# Altium project ControlUnit.PrjPCB
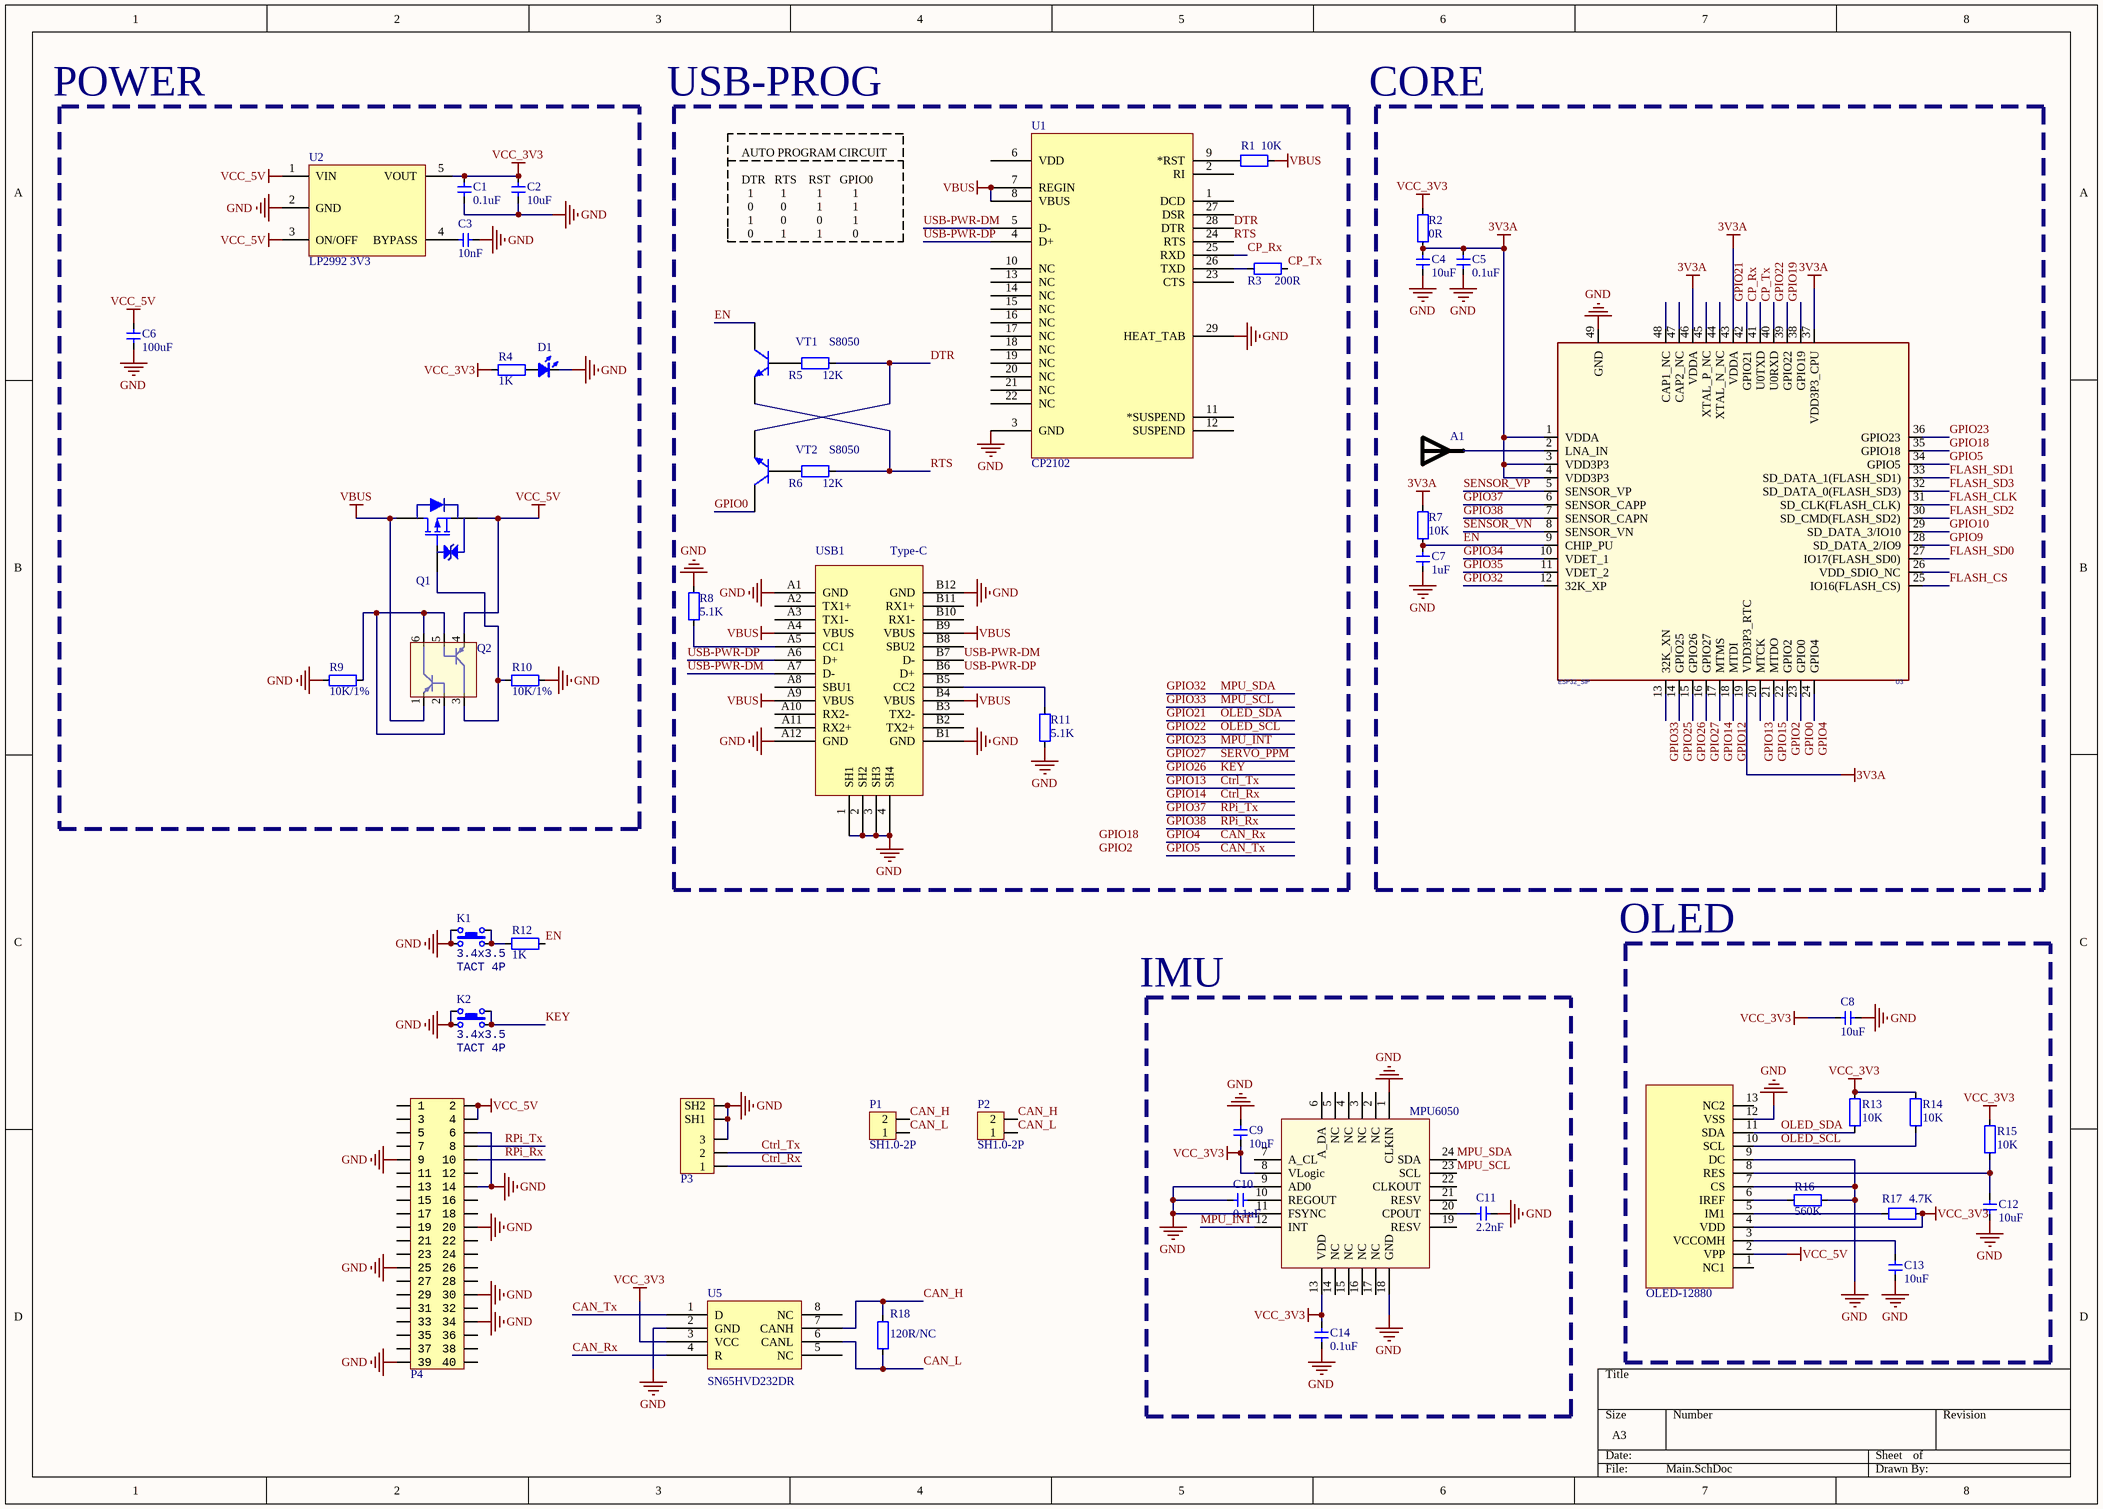
[diagram p0: Main.SchDoc]
1 sheet, 51 parts. Net scope: global (net labels, ports and power ports of the same name join across sheets).
Board file: ControlUnit.PcbDoc

## Sheet Main.SchDoc
size A3

### Parts
1  OLED-12880  [OLED-12880]
A1  RAINSUN  [ANT-Rainsun-AN5120]  (value not drawn)
C1  0.1uF  [CAP_0402]
C2  10uF  [CAP_0402]
C3  10nF  [CAP_0402]
C4  10uF  [CAP_0402]
C5  0.1uF  [CAP_0402]
C6  100uF  [1206-CAP]
C7  1uF  [CAP_0402]
C8  10uF  [CAP_0402]
C9  10nF  [CAP_0402]
C10  0.1uF  [CAP_0402]
C11  2.2nF  [CAP_0402]
C12  10uF  [CAP_0402]
C13  10uF  [CAP_0402]
C14  0.1uF  [CAP_0402]
D1  color?  [LED_0402_RED]  (value not drawn)
K1  value 3.4x3.5  [ButtonTACT_3.5*3.55_90]  (hidden comment: TACT 4P)
K2  value 3.4x3.5  [ButtonTACT_3.5*3.55_90]  (hidden comment: TACT 4P)
P1  SH1.0-2P  [SH1.0-2P]
P2  SH1.0-2P  [SH1.0-2P]
P3  SH1.0-3P  [SH1.0-3P]  (value not drawn)
P4  HDR2x20_2.54  [HDR2X20_2.54_180F]  (value not drawn)
Q1  AO3415A  [SOT23-3]  (value not drawn)
Q2  BCM856BS  [SOT363-6]  (value not drawn)
R1  10K  [RES_0402]
R2  0R  [RES_0402]
R3  200R  [RES_0402]
R4  1K  [RES_0402]
R5  12K  [RES_0402]
R6  12K  [RES_0402]
R7  10K  [RES_0402]
R8  5.1K  [RES_0402]
R9  10K/1%  [RES_0402]
R10  10K/1%  [RES_0402]
R11  5.1K  [RES_0402]
R12  1K  [RES_0402]
R13  10K  [RES_0402]
R14  10K  [RES_0402]
R15  10K  [RES_0402]
R16  560K  [RES_0402]
R17  4.7K  [RES_0402]
R18  120R/NC  [RES_0402]
U1  CP2102  [QFN-28]
U2  LP2992 3V3  [SOT23-5]
U3  ESP32_SIP  [QFN-48_7X7]
U4  MPU6050  [QFN-24]
U5  Manufacturer Part Number: SN65HVD232DR  [SO-8]  (hidden comment: SN65HVD232D)
USB1  Type-C  [Type-C-TOP]
VT1  S8050  [SMT_TRIODE_NPN]
VT2  S8050  [SMT_TRIODE_NPN]

### Nets
3V3A: C4.2 C5.2 R2.2 R7.1 U3.1(VDDA) U3.3(VDD3P3) U3.4(VDD3P3) U3.19(VDD3P3_RTC) U3.37(VDD3P3_CPU) U3.43(VDDA) U3.46(VDDA)
GND: 1.7(CS) 1.9(DC) 1.12(VSS) C1.1 C2.1 C3.1 C4.1 C5.1 C6.1 C7.2 C8.1 C9.2 C10.2 C11.1 C12.1 C13.1 C14.1 D1.2(K) K1.1 K1.3 K2.1 K2.3 P3.3 P3.SH1 P3.SH2 P4.6 P4.9 P4.14 P4.20 P4.25 P4.30 P4.34 P4.39 R8.1 R9.1 R10.2 R11.1 R16.2 U1.3(GND) U1.29(HEAT_TAB) U2.2(GND) U3.49(GND) U4.1(CLKIN) U4.9(AD0) U4.11(FSYNC) U4.18(GND) U5.2(GND) USB1.1(SH1) USB1.2(SH2) USB1.3(SH3) USB1.4(SH4) USB1.A1(GND) USB1.A12(GND) USB1.B1(GND) USB1.B12(GND)
VBUS: Q1.3(D) Q2.1 R1.1 U1.7(REGIN) U1.8(VBUS) USB1.A4(VBUS) USB1.A9(VBUS) USB1.B4(VBUS) USB1.B9(VBUS)
VCC_3V3: 1.4(VDD) C1.2 C2.2 C8.2 C9.1 C14.2 R2.1 R4.1 R13.2 R14.2 R15.2 R17.2 U2.5(VOUT) U4.8(VLogic) U4.13(VDD) U5.3(VCC)
VCC_5V: 1.2(VPP) C6.2 P4.2 P4.4 Q1.2(S) Q2.4 U2.1(VIN) U2.3(ON/OFF)
CAN_H: P1.2 P2.2 R18.1 U5.7(CANH)
CAN_L: P1.1 P2.1 R18.2 U5.6(CANL)
CAN_Rx: U3.24(GPIO4) U5.4(R)  [also labelled GPIO4]
CAN_Tx: U3.34(GPIO5) U5.1(D)  [also labelled GPIO5]
CP_Rx: U1.25(RXD) U3.41(U0TXD)
CP_Tx: R3.1 U3.40(U0RXD)
Ctrl_Rx: P3.1 U3.17(MTMS)  [also labelled GPIO14]
Ctrl_Tx: P3.2 U3.20(MTCK)  [also labelled GPIO13]
DTR: R5.1 U1.28(DTR) VT2.2(E)
EN: C7.1 R7.2 R12.2 U3.9(CHIP_PU) VT1.3(C)
FLASH_CLK: U3.31(SD_CLK(FLASH_CLK))
FLASH_CS: U3.25(IO16(FLASH_CS))
FLASH_SD0: U3.27(IO17(FLASH_SD0))
FLASH_SD1: U3.33(SD_DATA_1(FLASH_SD1))
FLASH_SD2: U3.30(SD_CMD(FLASH_SD2))
FLASH_SD3: U3.32(SD_DATA_0(FLASH_SD3))
GPIO0: U3.23(GPIO0) VT2.3(C)
GPIO2: U3.22(GPIO2)
GPIO9: U3.28(SD_DATA_2/IO9)
GPIO10: U3.29(SD_DATA_3/IO10)
GPIO12: U3.18(MTDI)
GPIO15: U3.21(MTDO)
GPIO18: U3.35(GPIO18)
GPIO19: U3.38(GPIO19)
GPIO21: 1.11(SDA) R13.1 U3.42(GPIO21)  [also labelled OLED_SDA]
GPIO22: 1.10(SCL) R14.1 U3.39(GPIO22)  [also labelled OLED_SCL]
GPIO23: U3.36(GPIO23) U4.12(INT)  [also labelled MPU_INT]
GPIO25: U3.14(GPIO25)
GPIO26: K2.2 K2.4 U3.15(GPIO26)  [also labelled KEY]
GPIO27: U3.16(GPIO27)  [also labelled SERVO_PPM]
GPIO32: U3.12(32K_XP) U4.24(SDA)  [also labelled MPU_SDA]
GPIO33: U3.13(32K_XN) U4.23(SCL)  [also labelled MPU_SCL]
GPIO34: U3.10(VDET_1)
GPIO35: U3.11(VDET_2)
GPIO37: P4.8 U3.6(SENSOR_CAPP)  [also labelled RPi_Tx]
GPIO38: P4.10 U3.7(SENSOR_CAPN)  [also labelled RPi_Rx]
RTS: R6.1 U1.24(RTS) VT1.2(E)
SENSOR_VN: U3.8(SENSOR_VN)
SENSOR_VP: U3.5(SENSOR_VP)
USB-PWR-DM: U1.5(D-) USB1.A7(D-) USB1.B7(D-)
USB-PWR-DP: U1.4(D+) USB1.A6(D+) USB1.B6(D+)
Net1_3: 1.3(VCCOMH) C13.2
Net1_5: 1.5(IM1) R17.1
Net1_6: 1.6(IREF) R16.1
Net1_8: 1.8(RES) C12.2 R15.1
NetA1_1: A1.1 U3.2(LNA_IN)
NetC3_2: C3.2 U2.4(BYPASS)
NetC10_1: C10.1 U4.10(REGOUT)
NetC11_2: C11.2 U4.20(CPOUT)
NetD1_1: D1.1(A) R4.2
NetK1_2: K1.2 K1.4 R12.1
NetQ1_1: Q1.1(G) Q2.3 R10.1
NetQ2_2: Q2.2 Q2.5 Q2.6 R9.2
NetR1_2: R1.2 U1.9(*RST)
NetR3_2: R3.2 U1.26(TXD)
NetR5_2: R5.2 VT1.1(B)
NetR6_2: R6.2 VT2.1(B)
NetR8_2: R8.2 USB1.A5(CC1)
NetR11_2: R11.2 USB1.B5(CC2)

Not connected (* = marked no-connect by the designer): 1 1(NC1) 13(NC2); P4 1 3 5 7 11 12 13 15 16 17 18 19 21 22 23 24 26 27 28 29 31 32 33 35 36 37 38 40; U1 1(DCD) 2(RI) 6(VDD) 10(NC) 11(*SUSPEND) 12(SUSPEND) 13(NC) 14(NC) 15(NC) 16(NC) 17(NC) 18(NC) 19(NC) 20(NC) 21(NC) 22(NC) 23(CTS) 27(DSR); U3 26(VDD_SDIO_NC) 44(XTAL_N_NC) 45(XTAL_P_NC) 47(CAP2_NC) 48(CAP1_NC); U4 2(NC) 3(NC) 4(NC) 5(NC) 6(A_DA) 7(A_CL) 14(NC) 15(NC) 16(NC) 17(NC) 19(RESV) 21(RESV) 22(CLKOUT); U5 5(NC) 8(NC); USB1 A2(TX1+) A3(TX1-) A8(SBU1) A10(RX2-) A11(RX2+) B2(TX2+) B3(TX2-) B8(SBU2) B10(RX1-) B11(RX1+)

### Notes on the sheet
- POWER
- USB-PROG
- CORE
- AUTO PROGRAM CIRCUIT
  DTR   RTS    RST   GPIO0
  1         1          1          1
  0         0          1          1
  1         0          0          1
  0         1          1          0
- IMU
- OLED
- Labels drawn without touching a wire or pin: GPIO2, GPIO18

### Library data of the parts
A1 = ANT-Rainsun-AP5120
C1-C5 C7-C14 = 电容-0402: Capacitor; Value: 0.1u
C6 = 电容-1206: Capacitor; Value: 0.1u
D1 = LED_0402: LED; Type: 0402; Value: color?
K1 K2 = ButtonTACT: Button; type: TACT 4P
P3 = SH1.0-3P: Header
P4 = HDR2x20_2.54: Header
Q1 = AO3415A: MOSFET; Published: 8-Jun-2000; LatestRevisionDate: 17-Jul-2002; LatestRevisionNote: Re-released for DXP Platform.; PackageVersion: 1995/1996; PackageReference: E3; Publisher: Altium Limited; PackageDescription: TO, Flat Index; 3 In-Line, Axial Leads; Body Dia. 4.6mm; Lead Dia. 0.5 mm (max)
Q2 = BCM856BS: Transistor
R1-R18 = 电阻-0402: Resistor; Value: 22R
U1 = CP2102: USB转TTL; PART DESC: SINGLE-CHIP USB TO UART BRIDGE, QFN28, RoHS.; MFG #1: SILICON LABS; PART NUMBER: CP2102; Value: Value; RefDes: RefDes; Type: DEV
U2 = LP2992: LDO
U3 = ESP32-PICO
U4 = MPU6050: 六轴传感器
U5 = SN65HVD232D: Manufacturer: Texas Instruments; Protocol: CAN; Number of Drivers/Receivers: 1/1; Duplex: Half; Data Rate: 1Mbps; Voltage - Supply: 3 V ~ 3.6 V; Supplier 1: Digi-Key; Supplier Part Number 1: 296-26344-2-ND; RoHS: RoHS Compliant; Category: Integrated Circuits (ICs); Stock: 5000; Pricing 1: 2500=0.84375 (USD); Packaging: Tape & Reel (TR); Part Status: Active; Type: Transceiver; Operating Temperature: -40°C ~ 85°C; Mounting Type: Surface Mount; Package / Case: 8-SOIC (0.154", 3.90mm Width); Supplier Device Package: 8-SOIC; ComponentLink1URL: http://www.ti.com/lit/ds/symlink/sn65hvd230.pdf; ComponentLink1Description: http://www.ti.com/lit/ds/symlink/sn65hvd230.pdf; Supplier 2: Digi-Key; Supplier Part Number 2: 296-26344-1-ND; Pricing 2: 1=2.05, 10=1.842, 100=1.4809, 500=1.21668, 1000=1.00811 (USD)
USB1 = USB-Type-C-TOP
VT1 VT2 = SMT_TRIODE_NPN: Surface mount NPN transistor, package SOT-23